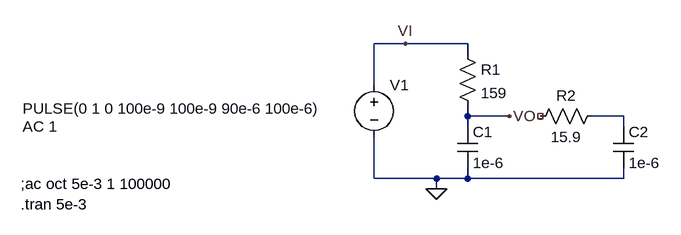
[diagram p0: schematic rc_pwm.asc]
rc_pwm.asc, the LTspice schematic file:
Version 4
SHEET 1 880 680
WIRE 96 0 48 0
WIRE 192 0 96 0
WIRE 192 16 192 0
WIRE 48 64 48 0
WIRE 192 112 192 96
WIRE 256 112 192 112
WIRE 432 112 384 112
WIRE 192 128 192 112
WIRE 432 128 432 112
WIRE 48 208 48 144
WIRE 144 208 48 208
WIRE 192 208 192 192
WIRE 192 208 144 208
WIRE 432 208 432 192
WIRE 432 208 192 208
WIRE 144 224 144 208
FLAG 144 224 0
FLAG 96 0 VI
FLAG 256 112 VO
SYMBOL cap 176 128 R0
SYMATTR InstName C1
SYMATTR Value 1e-6
SYMBOL res 176 0 R0
SYMATTR InstName R1
SYMATTR Value 159
SYMBOL voltage 48 48 R0
WINDOW 3 -541 52 Left 2
WINDOW 123 -541 80 Left 2
WINDOW 39 0 0 Left 0
SYMATTR Value PULSE(0 1 0 100e-9 100e-9 90e-6 100e-6)
SYMATTR Value2 AC 1
SYMATTR InstName V1
SYMBOL res 400 96 R90
WINDOW 0 0 56 VBottom 2
WINDOW 3 32 56 VTop 2
SYMATTR InstName R2
SYMATTR Value 15.9
SYMBOL cap 416 128 R0
SYMATTR InstName C2
SYMATTR Value 1e-6
TEXT -496 248 Left 2 !.tran 5e-3
TEXT -496 216 Left 2 !;ac oct 5e-3 1 100000

The netlist it stands for:
* rc_pwm.asc
C1 VO 0 1e-6
R1 VI VO 159
V1 VI 0 PULSE(0 1 0 100e-9 100e-9 90e-6 100e-6) AC 1
R2 N001 NC_01 15.9
C2 N001 0 1e-6
.tran 5e-3
;ac oct 5e-3 1 100000
.backanno
.end

* Results of the author's LTspice run, read from the files saved beside the schematic
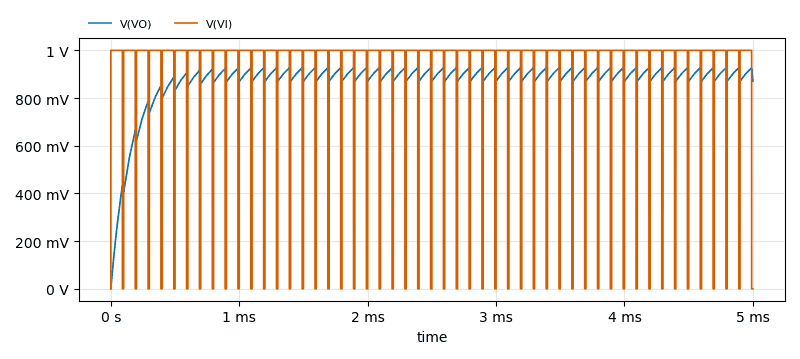
[diagram p1: Transient Analysis of rc_pwm.asc, plotted from the saved traces]
* Transient Analysis, 1 run:
*   V(VO): min 0 V, max 926.6 mV, average 872.7 mV, rms 879.5 mV, last 871 mV
*   V(VI): min 0 V, max 1 V, average 901 mV, rms 949.2 mV, last 0 V